# EAGLE schematic infinity_mirror (EAGLE 9.6.2)
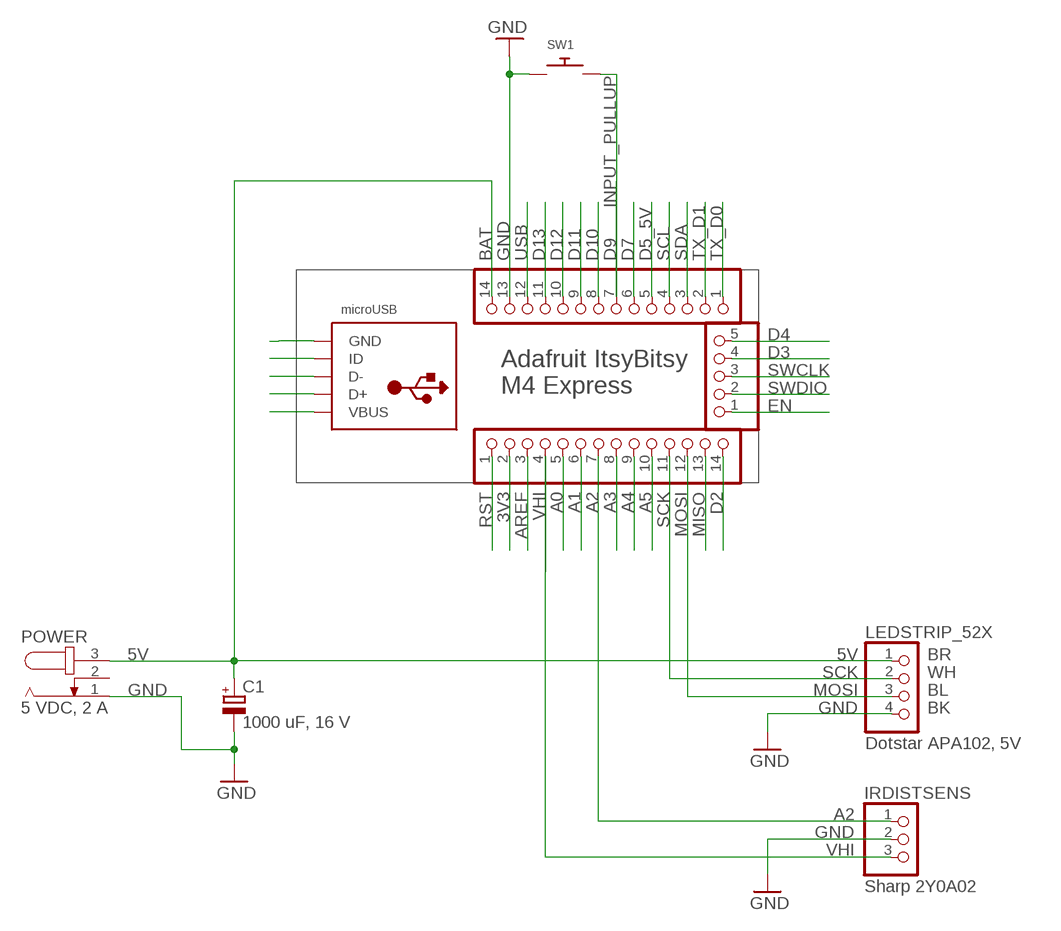
[diagram p0: schematic, sheet 1]

## Parts
C1  1000 uF, 16 V  CPOL-EUE3.5-8  [E3,5-8]
IRDISTSENS  Sharp 2Y0A02  PINHD-1X3  [1X03]
JP1  PINHD-1X14  [1X14]
JP2  PINHD-1X14  [1X14]
JP4  PINHD-1X5  [1X05]
LEDSTRIP_52X  Dotstar APA102, 5V  PINHD-1X4  [1X04]
POWER  5 VDC, 2 A  JACK-PLUG1  [SPC4078]
SW1  SWITCH_PUSHBUTTONSOFTTOUCHSMD_SJ  [PUSHBUTTON_SMD_SJ]
X3  microUSB  USB_MICRO_20329_V2  [4UCONN_20329_V2]

## Nets
3V3: JP2.2
5V: C1.+ JP1.14 LEDSTRIP_52X.1 POWER.3
A0: JP2.5
A1: JP2.6
A2: IRDISTSENS.1 JP2.7
A3: JP2.8
A4: JP2.9
A5: JP2.10
AREF: JP2.3
D2: JP2.14
D3: JP4.4
D4: JP4.5
D5_5V: JP1.5
D7: JP1.6
D9: JP1.7 SW1.P$2
D10: JP1.8
D11: JP1.9
D12: JP1.10
D13: JP1.11
EN: JP4.1
GND: C1.- IRDISTSENS.2 JP1.13 LEDSTRIP_52X.4 POWER.1 SW1.P$1
MISO: JP2.13
MOSI: JP2.12 LEDSTRIP_52X.3
N$1: X3.BASE@1(GND) X3.BASE@2(GND) X3.GND X3.SPRT@1(GND) X3.SPRT@2(GND) X3.SPRT@3(GND) X3.SPRT@4(GND)
N$2: X3.ID
N$3: X3.D-
N$4: X3.D+
N$5: X3.VBUS
RST: JP2.1
SCK: JP2.11 LEDSTRIP_52X.2
SCL: JP1.4
SDA: JP1.3
SWCLK: JP4.3
SWDIO: JP4.2
TX_D0: JP1.1
TX_D1: JP1.2
USB: JP1.12
VHI: IRDISTSENS.3 JP2.4
Unconnected: POWER.2

## Notes on the sheet
- INPUT_PULLUP
- BAT
- Adafruit ItsyBitsy
  M4 Express
- BR
- WH
- BL
- BK

## Library data of the parts
C1 = rcl:CPOL-EU: POLARIZED CAPACITOR, European symbol; SPICEPREFIX: C
IRDISTSENS = pinhead:PINHD-1X3: PIN HEADER
JP1 JP2 = pinhead:PINHD-1X14: PIN HEADER
JP4 = pinhead:PINHD-1X5: PIN HEADER
LEDSTRIP_52X = pinhead:PINHD-1X4: PIN HEADER
POWER = con-jack:JACK-PLUG: DC POWER JACK Power Jack, DC, Right Angle, Through Hole, Rated 5A at 16VDC, PC Terminals Distributor: Farnell (www.Farnell.de) Drawing: 84N1161.pdf / 84N1162.pdf Manufacturer: SPC Technology (www.spctechnology.com) Type: SPC4077 / SPC 4078; OC_FARNELL: unknown; OC_NEWARK: unknown
SW1 = adafruit:SWITCH_PUSHBUTTON: Buttons SOFTTOUCHSMD_SJ - Soft touch temporary push button (Super Junk Akihabara) Compatible with SKPMANE010 [Mouser: 688-SKPMAN] C&K_KSS = Digikey: KSS221GLFS
X3 = microbuilder:USB: USB Connectors USBMINIB - Surface Mount Female Mini-B USB Connector 4UConnector: 06564